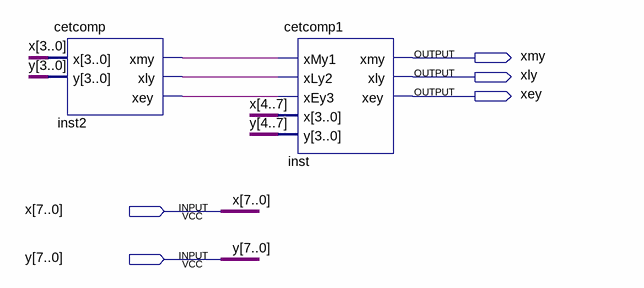
[diagram p0: schematic sheet]
// Quartus schematic voscomp.bdf as structural Verilog: 2 symbols, 5 pins
module voscomp (
  input  [7:0] x,
  input  [7:0] y,
  output xmy,
  output xly,
  output xey
);

  wire inst2_xey, inst2_xly, inst2_xmy;

  cetcomp inst2 (.x(x[3:0]), .y(y[3:0]), .xmy(inst2_xmy), .xly(inst2_xly), .xey(inst2_xey));
  cetcomp1 inst (
    .xMy1(inst2_xmy), .xLy2(inst2_xly), .xEy3(inst2_xey), .x({x[4], x[5], x[6], x[7]}),
    .y({y[4], y[5], y[6], y[7]}), .xmy(xmy), .xly(xly), .xey(xey));
endmodule
